# Altium schematic sheet schematic.SchDoc
size 464 x 561 mm; SheetNumber: 1; SheetTotal: 1
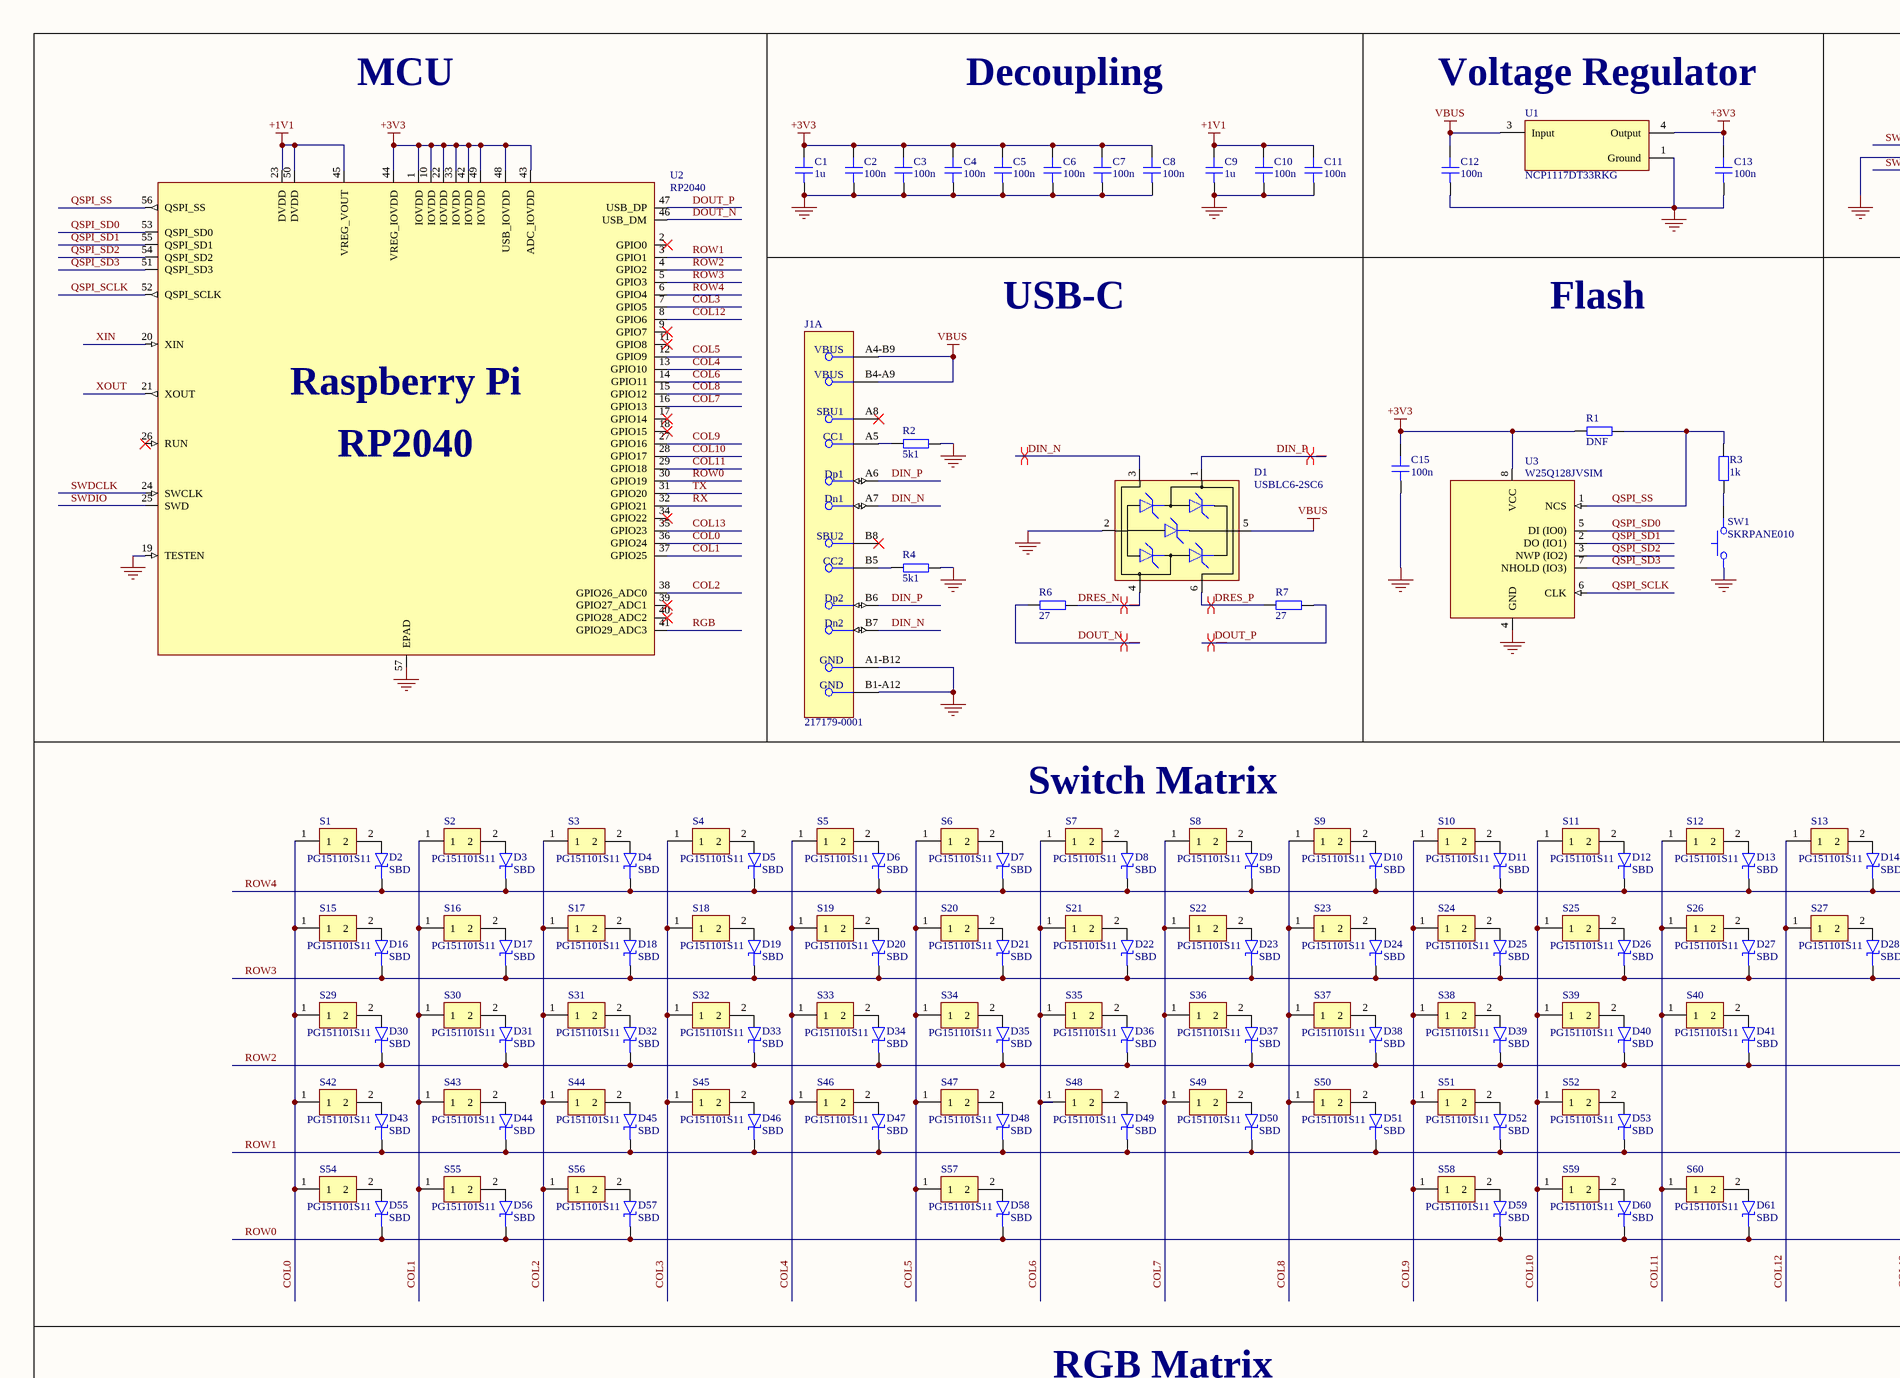
[diagram p0: schematic.SchDoc, top left]
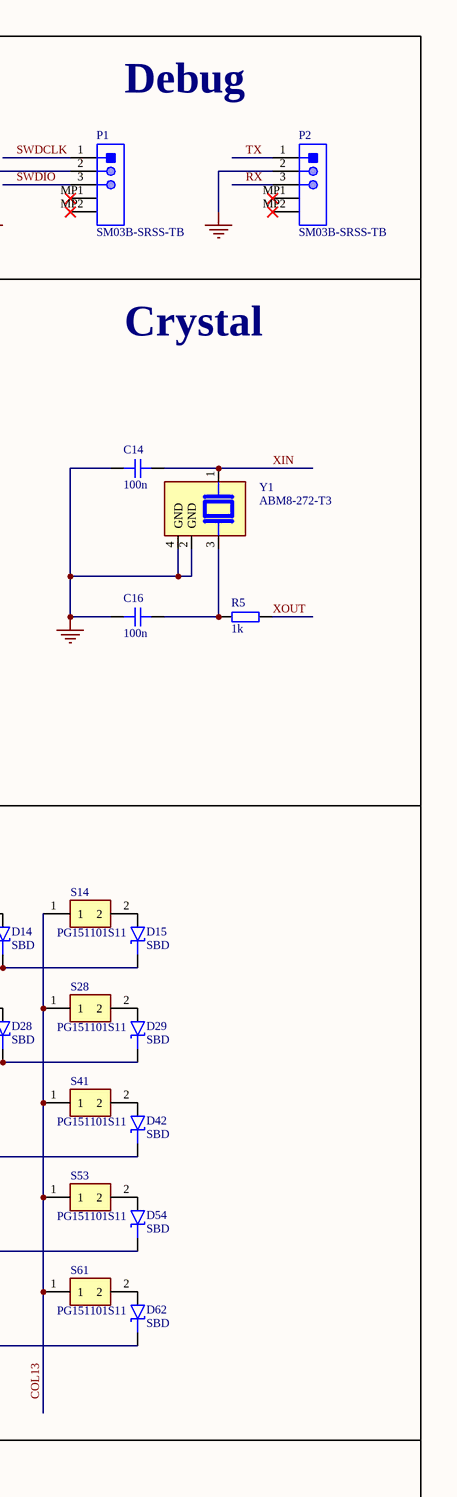
[diagram p1: schematic.SchDoc, top right]
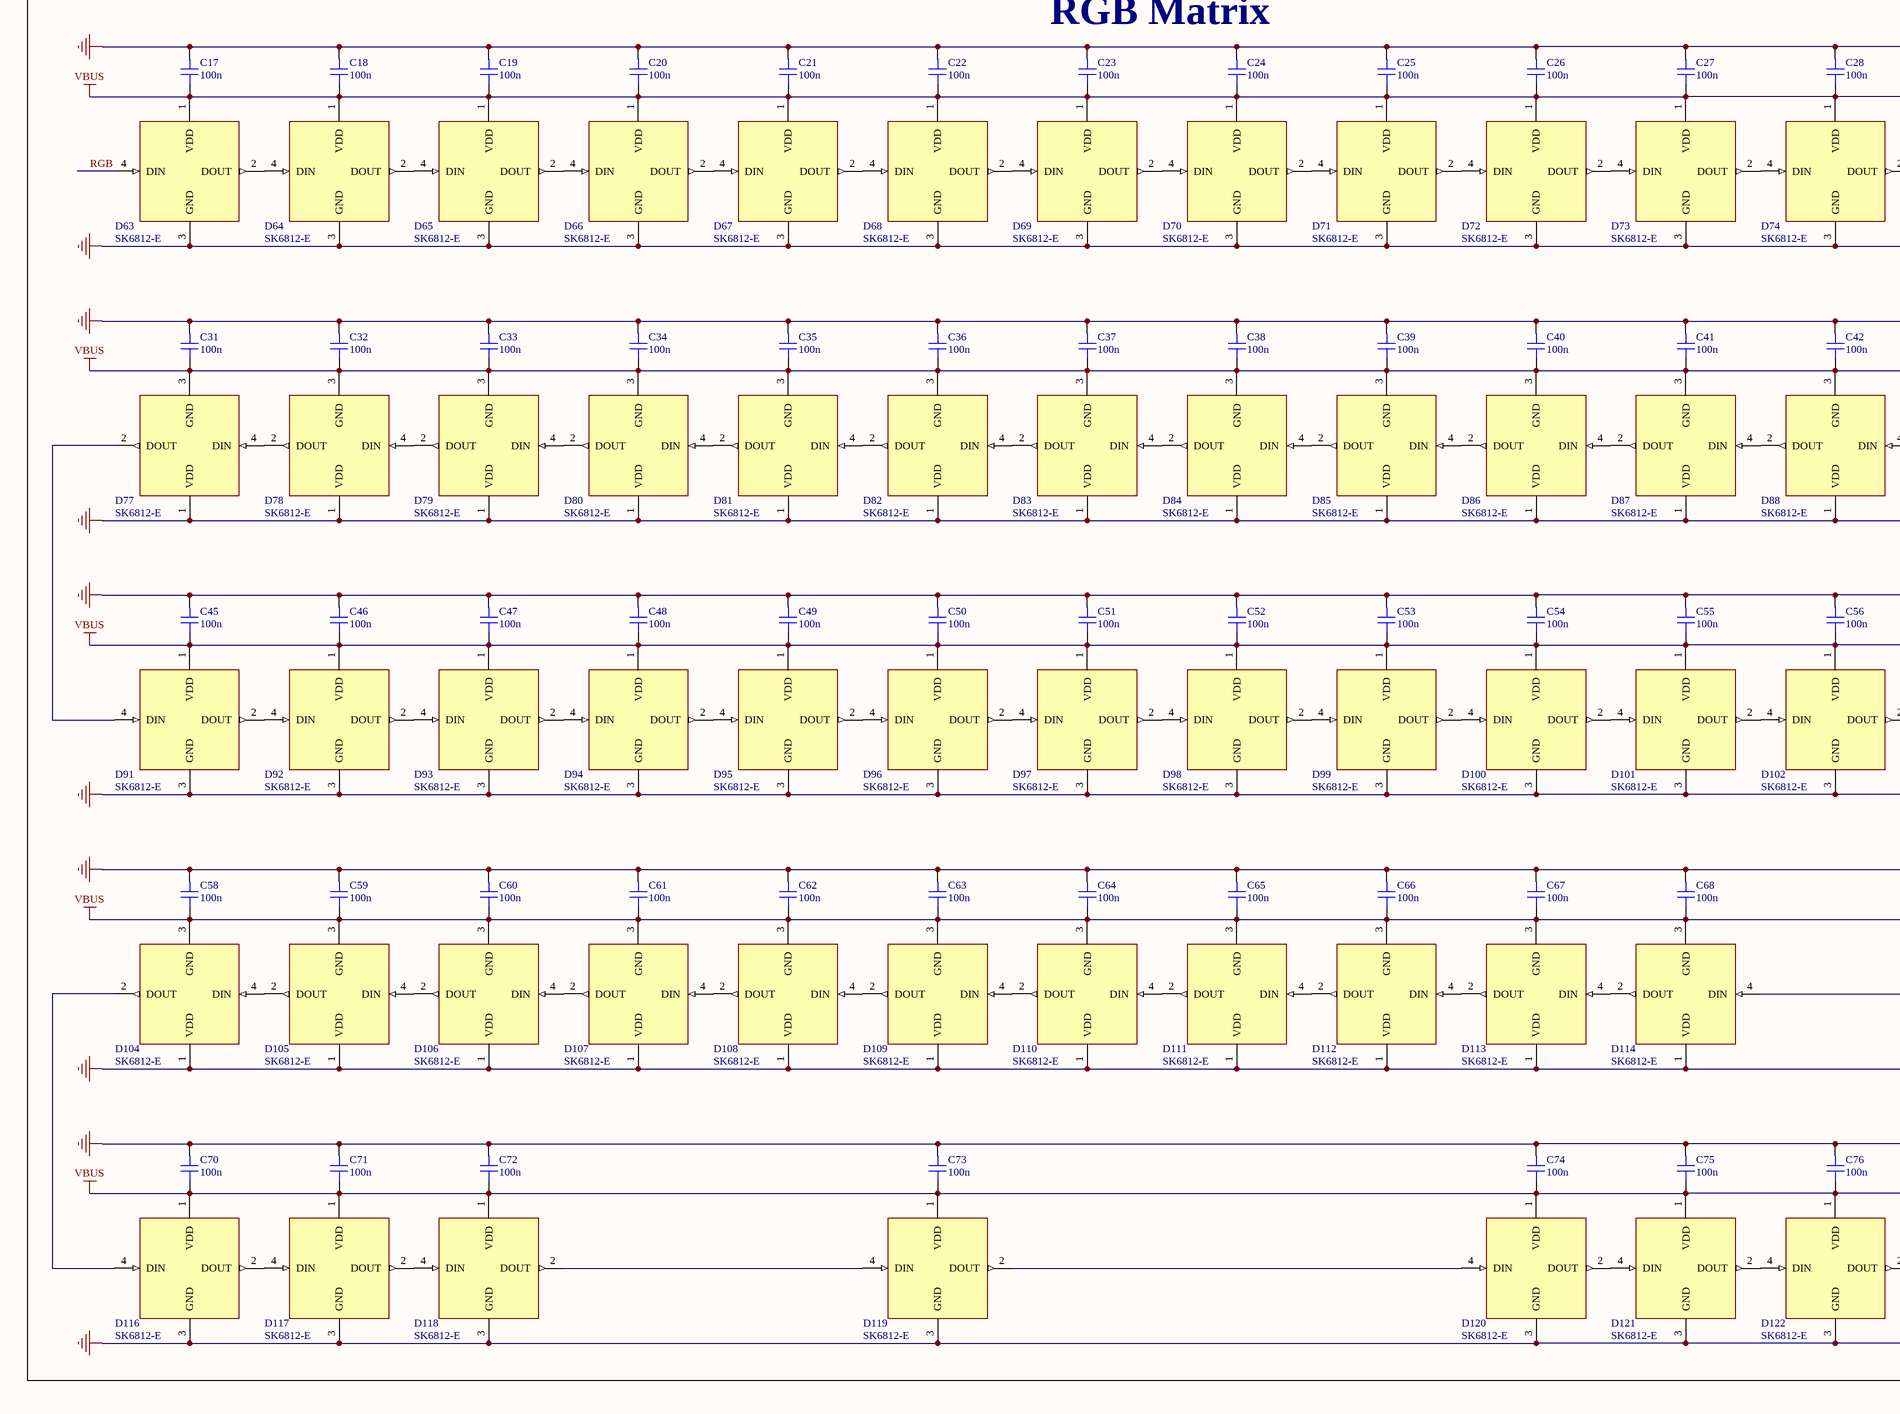
[diagram p2: schematic.SchDoc, bottom left]
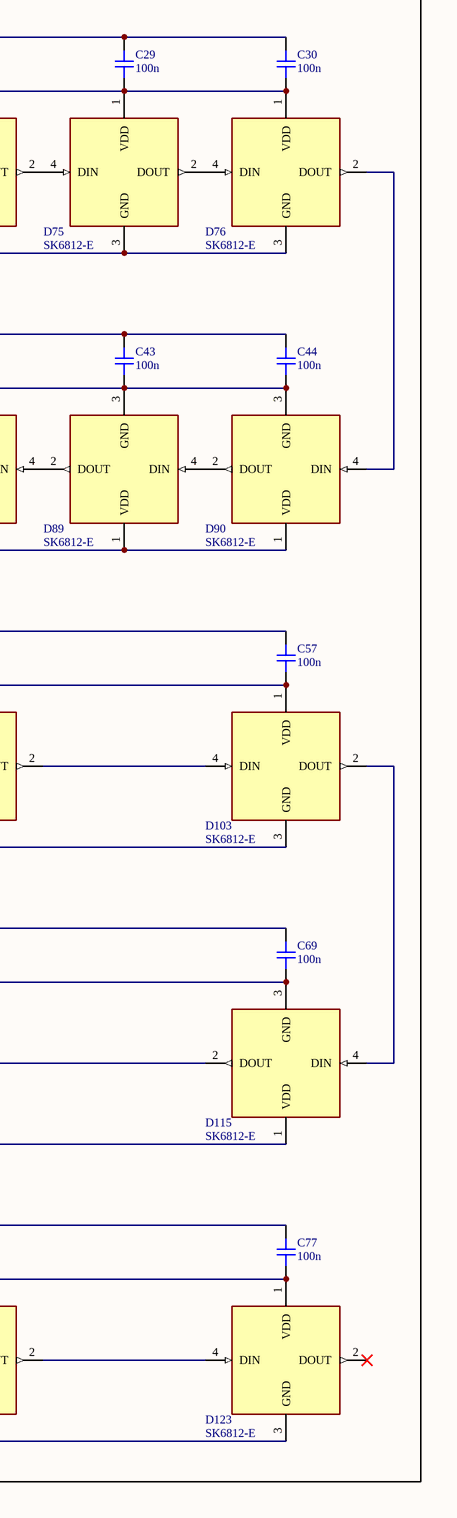
[diagram p3: schematic.SchDoc, bottom right]

## Parts
C1  1u  [CAP_0402]
C2  100n  [CAP_0402]
C3  100n  [CAP_0402]
C4  100n  [CAP_0402]
C5  100n  [CAP_0402]
C6  100n  [CAP_0402]
C7  100n  [CAP_0402]
C8  100n  [CAP_0402]
C9  1u  [CAP_0402]
C10  100n  [CAP_0402]
C11  100n  [CAP_0402]
C12  100n  [CAP_0402]
C13  100n  [CAP_0402]
C14  100n  [CAP_0402]
C15  100n  [CAP_0402]
C16  100n  [CAP_0402]
C17  100n  [CAP_1206]
C18  100n  [CAP_1206]
C19  100n  [CAP_1206]
C20  100n  [CAP_1206]
C21  100n  [CAP_1206]
C22  100n  [CAP_1206]
C23  100n  [CAP_1206]
C24  100n  [CAP_1206]
C25  100n  [CAP_1206]
C26  100n  [CAP_1206]
C27  100n  [CAP_1206]
C28  100n  [CAP_1206]
C29  100n  [CAP_1206]
C30  100n  [CAP_1206]
C31  100n  [CAP_1206]
C32  100n  [CAP_1206]
C33  100n  [CAP_1206]
C34  100n  [CAP_1206]
C35  100n  [CAP_1206]
C36  100n  [CAP_1206]
C37  100n  [CAP_1206]
C38  100n  [CAP_1206]
C39  100n  [CAP_1206]
C40  100n  [CAP_1206]
C41  100n  [CAP_1206]
C42  100n  [CAP_1206]
C43  100n  [CAP_1206]
C44  100n  [CAP_1206]
C45  100n  [CAP_1206]
C46  100n  [CAP_1206]
C47  100n  [CAP_1206]
C48  100n  [CAP_1206]
C49  100n  [CAP_1206]
C50  100n  [CAP_1206]
C51  100n  [CAP_1206]
C52  100n  [CAP_1206]
C53  100n  [CAP_1206]
C54  100n  [CAP_1206]
C55  100n  [CAP_1206]
C56  100n  [CAP_1206]
C57  100n  [CAP_1206]
C58  100n  [CAP_1206]
C59  100n  [CAP_1206]
C60  100n  [CAP_1206]
C61  100n  [CAP_1206]
C62  100n  [CAP_1206]
C63  100n  [CAP_1206]
C64  100n  [CAP_1206]
C65  100n  [CAP_1206]
C66  100n  [CAP_1206]
C67  100n  [CAP_1206]
C68  100n  [CAP_1206]
C69  100n  [CAP_1206]
C70  100n  [CAP_1206]
C71  100n  [CAP_1206]
C72  100n  [CAP_1206]
C73  100n  [CAP_1206]
C74  100n  [CAP_1206]
C75  100n  [CAP_1206]
C76  100n  [CAP_1206]
C77  100n  [CAP_1206]
D1  USBLC6-2SC6  [SOT-23-6]
D2  SBD  [SOD-323]
D3  SBD  [SOD-323]
D4  SBD  [SOD-323]
D5  SBD  [SOD-323]
D6  SBD  [SOD-323]
D7  SBD  [SOD-323]
D8  SBD  [SOD-323]
D9  SBD  [SOD-323]
D10  SBD  [SOD-323]
D11  SBD  [SOD-323]
D12  SBD  [SOD-323]
D13  SBD  [SOD-323]
D14  SBD  [SOD-323]
D15  SBD  [SOD-323]
D16  SBD  [SOD-323]
D17  SBD  [SOD-323]
D18  SBD  [SOD-323]
D19  SBD  [SOD-323]
D20  SBD  [SOD-323]
D21  SBD  [SOD-323]
D22  SBD  [SOD-323]
D23  SBD  [SOD-323]
D24  SBD  [SOD-323]
D25  SBD  [SOD-323]
D26  SBD  [SOD-323]
D27  SBD  [SOD-323]
D28  SBD  [SOD-323]
D29  SBD  [SOD-323]
D30  SBD  [SOD-323]
D31  SBD  [SOD-323]
D32  SBD  [SOD-323]
D33  SBD  [SOD-323]
D34  SBD  [SOD-323]
D35  SBD  [SOD-323]
D36  SBD  [SOD-323]
D37  SBD  [SOD-323]
D38  SBD  [SOD-323]
D39  SBD  [SOD-323]
D40  SBD  [SOD-323]
D41  SBD  [SOD-323]
D42  SBD  [SOD-323]
D43  SBD  [SOD-323]
D44  SBD  [SOD-323]
D45  SBD  [SOD-323]
D46  SBD  [SOD-323]
D47  SBD  [SOD-323]
D48  SBD  [SOD-323]
D49  SBD  [SOD-323]
D50  SBD  [SOD-323]
D51  SBD  [SOD-323]
D52  SBD  [SOD-323]
D53  SBD  [SOD-323]
D54  SBD  [SOD-323]
D55  SBD  [SOD-323]
D56  SBD  [SOD-323]
D57  SBD  [SOD-323]
D58  SBD  [SOD-323]
D59  SBD  [SOD-323]
D60  SBD  [SOD-323]
D61  SBD  [SOD-323]
D62  SBD  [SOD-323]
D63  SK6812-E  [LED_SK6812-E]
D64  SK6812-E  [LED_SK6812-E]
D65  SK6812-E  [LED_SK6812-E]
D66  SK6812-E  [LED_SK6812-E]
D67  SK6812-E  [LED_SK6812-E]
D68  SK6812-E  [LED_SK6812-E]
D69  SK6812-E  [LED_SK6812-E]
D70  SK6812-E  [LED_SK6812-E]
D71  SK6812-E  [LED_SK6812-E]
D72  SK6812-E  [LED_SK6812-E]
D73  SK6812-E  [LED_SK6812-E]
D74  SK6812-E  [LED_SK6812-E]
D75  SK6812-E  [LED_SK6812-E]
D76  SK6812-E  [LED_SK6812-E]
D77  SK6812-E  [LED_SK6812-E]
D78  SK6812-E  [LED_SK6812-E]
D79  SK6812-E  [LED_SK6812-E]
D80  SK6812-E  [LED_SK6812-E]
D81  SK6812-E  [LED_SK6812-E]
D82  SK6812-E  [LED_SK6812-E]
D83  SK6812-E  [LED_SK6812-E]
D84  SK6812-E  [LED_SK6812-E]
D85  SK6812-E  [LED_SK6812-E]
D86  SK6812-E  [LED_SK6812-E]
D87  SK6812-E  [LED_SK6812-E]
D88  SK6812-E  [LED_SK6812-E]
D89  SK6812-E  [LED_SK6812-E]
D90  SK6812-E  [LED_SK6812-E]
D91  SK6812-E  [LED_SK6812-E]
D92  SK6812-E  [LED_SK6812-E]
D93  SK6812-E  [LED_SK6812-E]
D94  SK6812-E  [LED_SK6812-E]
D95  SK6812-E  [LED_SK6812-E]
D96  SK6812-E  [LED_SK6812-E]
D97  SK6812-E  [LED_SK6812-E]
D98  SK6812-E  [LED_SK6812-E]
D99  SK6812-E  [LED_SK6812-E]
D100  SK6812-E  [LED_SK6812-E]
D101  SK6812-E  [LED_SK6812-E]
D102  SK6812-E  [LED_SK6812-E]
D103  SK6812-E  [LED_SK6812-E]
D104  SK6812-E  [LED_SK6812-E]
D105  SK6812-E  [LED_SK6812-E]
D106  SK6812-E  [LED_SK6812-E]
D107  SK6812-E  [LED_SK6812-E]
D108  SK6812-E  [LED_SK6812-E]
D109  SK6812-E  [LED_SK6812-E]
D110  SK6812-E  [LED_SK6812-E]
D111  SK6812-E  [LED_SK6812-E]
D112  SK6812-E  [LED_SK6812-E]
D113  SK6812-E  [LED_SK6812-E]
D114  SK6812-E  [LED_SK6812-E]
D115  SK6812-E  [LED_SK6812-E]
D116  SK6812-E  [LED_SK6812-E]
D117  SK6812-E  [LED_SK6812-E]
D118  SK6812-E  [LED_SK6812-E]
D119  SK6812-E  [LED_SK6812-E]
D120  SK6812-E  [LED_SK6812-E]
D121  SK6812-E  [LED_SK6812-E]
D122  SK6812-E  [LED_SK6812-E]
D123  SK6812-E  [LED_SK6812-E]
J1  217179-0001  [FP-2171790001-MFG]  (part A of 2)
P1  SM03B-SRSS-TB  [JST-SM03B-SRSS-TB_V]
P2  SM03B-SRSS-TB  [JST-SM03B-SRSS-TB_V]
R1  DNF  [RES_0402]
R2  5k1  [RES_0402]
R3  1k  [RES_0402]
R4  5k1  [RES_0402]
R5  1k  [RES_0402]
R6  27  [RES_0402]
R7  27  [RES_0402]
S1  PG151101S11  [SW_PG151101S11]
S2  PG151101S11  [SW_PG151101S11]
S3  PG151101S11  [SW_PG151101S11]
S4  PG151101S11  [SW_PG151101S11]
S5  PG151101S11  [SW_PG151101S11]
S6  PG151101S11  [SW_PG151101S11]
S7  PG151101S11  [SW_PG151101S11]
S8  PG151101S11  [SW_PG151101S11]
S9  PG151101S11  [SW_PG151101S11]
S10  PG151101S11  [SW_PG151101S11]
S11  PG151101S11  [SW_PG151101S11]
S12  PG151101S11  [SW_PG151101S11]
S13  PG151101S11  [SW_PG151101S11]
S14  PG151101S11  [SW_PG151101S11]
S15  PG151101S11  [SW_PG151101S11]
S16  PG151101S11  [SW_PG151101S11]
S17  PG151101S11  [SW_PG151101S11]
S18  PG151101S11  [SW_PG151101S11]
S19  PG151101S11  [SW_PG151101S11]
S20  PG151101S11  [SW_PG151101S11]
S21  PG151101S11  [SW_PG151101S11]
S22  PG151101S11  [SW_PG151101S11]
S23  PG151101S11  [SW_PG151101S11]
S24  PG151101S11  [SW_PG151101S11]
S25  PG151101S11  [SW_PG151101S11]
S26  PG151101S11  [SW_PG151101S11]
S27  PG151101S11  [SW_PG151101S11]
S28  PG151101S11  [SW_PG151101S11]
S29  PG151101S11  [SW_PG151101S11]
S30  PG151101S11  [SW_PG151101S11]
S31  PG151101S11  [SW_PG151101S11]
S32  PG151101S11  [SW_PG151101S11]
S33  PG151101S11  [SW_PG151101S11]
S34  PG151101S11  [SW_PG151101S11]
S35  PG151101S11  [SW_PG151101S11]
S36  PG151101S11  [SW_PG151101S11]
S37  PG151101S11  [SW_PG151101S11]
S38  PG151101S11  [SW_PG151101S11]
S39  PG151101S11  [SW_PG151101S11]
S40  PG151101S11  [SW_PG151101S11]
S41  PG151101S11  [SW_PG151101S11]
S42  PG151101S11  [SW_PG151101S11]
S43  PG151101S11  [SW_PG151101S11]
S44  PG151101S11  [SW_PG151101S11]
S45  PG151101S11  [SW_PG151101S11]
S46  PG151101S11  [SW_PG151101S11]
S47  PG151101S11  [SW_PG151101S11]
S48  PG151101S11  [SW_PG151101S11]
S49  PG151101S11  [SW_PG151101S11]
S50  PG151101S11  [SW_PG151101S11]
S51  PG151101S11  [SW_PG151101S11]
S52  PG151101S11  [SW_PG151101S11]
S53  PG151101S11  [SW_PG151101S11]
S54  PG151101S11  [SW_PG151101S11]
S55  PG151101S11  [SW_PG151101S11]
S56  PG151101S11  [SW_PG151101S11]
S57  PG151101S11  [SW_PG151101S11]
S58  PG151101S11  [SW_PG151101S11]
S59  PG151101S11  [SW_PG151101S11]
S60  PG151101S11  [SW_PG151101S11]
S61  PG151101S11  [SW_PG151101S11]
SW1  SKRPANE010  [SKRPANE010]
U1  NCP1117DT33RKG  [FP-369C-MFG]
U2  RP2040  [QFN-56-EP]
U3  W25Q128JVSIM  [SOIC-8]
Y1  ABM8-272-T3  [XTAL_ABM8-272-T3]

## Nets
+1V1: C9.2 C10.2 C11.2 U2.23(DVDD) U2.45(VREG_VOUT) U2.50(DVDD)
+3V3: C1.2 C2.2 C3.2 C4.2 C5.2 C6.2 C7.2 C8.2 C13.2 C15.2 R1.1 U1.4(Output) U2.1(IOVDD) U2.10(IOVDD) U2.22(IOVDD) U2.33(IOVDD) U2.42(IOVDD) U2.43(ADC_IOVDD) U2.44(VREG_IOVDD) U2.48(USB_IOVDD) U2.49(IOVDD) U3.8(VCC)
GND: C1.1 C2.1 C3.1 C4.1 C5.1 C6.1 C7.1 C8.1 C9.1 C10.1 C11.1 C12.1 C13.1 C14.2 C15.1 C16.2 C17.1 C18.1 C19.1 C20.1 C21.1 C22.1 C23.1 C24.1 C25.1 C26.1 C27.1 C28.1 C29.1 C30.1 C31.1 C32.1 C33.1 C34.1 C35.1 C36.1 C37.1 C38.1 C39.1 C40.1 C41.1 C42.1 C43.1 C44.1 C45.1 C46.1 C47.1 C48.1 C49.1 C50.1 C51.1 C52.1 C53.1 C54.1 C55.1 C56.1 C57.1 C58.1 C59.1 C60.1 C61.1 C62.1 C63.1 C64.1 C65.1 C66.1 C67.1 C68.1 C69.1 C70.1 C71.1 C72.1 C73.1 C74.1 C75.1 C76.1 C77.1 D1.2(GND) D63.3(GND) D64.3(GND) D65.3(GND) D66.3(GND) D67.3(GND) D68.3(GND) D69.3(GND) D70.3(GND) D71.3(GND) D72.3(GND) D73.3(GND) D74.3(GND) D75.3(GND) D76.3(GND) D77.1(VDD) D78.1(VDD) D79.1(VDD) D80.1(VDD) D81.1(VDD) D82.1(VDD) D83.1(VDD) D84.1(VDD) D85.1(VDD) D86.1(VDD) D87.1(VDD) D88.1(VDD) D89.1(VDD) D90.1(VDD) D91.3(GND) D92.3(GND) D93.3(GND) D94.3(GND) D95.3(GND) D96.3(GND) D97.3(GND) D98.3(GND) D99.3(GND) D100.3(GND) D101.3(GND) D102.3(GND) D103.3(GND) D104.1(VDD) D105.1(VDD) D106.1(VDD) D107.1(VDD) D108.1(VDD) D109.1(VDD) D110.1(VDD) D111.1(VDD) D112.1(VDD) D113.1(VDD) D114.1(VDD) D115.1(VDD) D116.3(GND) D117.3(GND) D118.3(GND) D119.3(GND) D120.3(GND) D121.3(GND) D122.3(GND) D123.3(GND) J1.A1-B12(GND) J1.B1-A12(GND) P1.2 P2.2 R2.2 R4.2 SW1.12 U1.1(Ground) U2.19(TESTEN) U2.57(EPAD) U3.4(GND) Y1.2(GND) Y1.4(GND)
VBUS: C12.2 C17.2 C18.2 C19.2 C20.2 C21.2 C22.2 C23.2 C24.2 C25.2 C26.2 C27.2 C28.2 C29.2 C30.2 C31.2 C32.2 C33.2 C34.2 C35.2 C36.2 C37.2 C38.2 C39.2 C40.2 C41.2 C42.2 C43.2 C44.2 C45.2 C46.2 C47.2 C48.2 C49.2 C50.2 C51.2 C52.2 C53.2 C54.2 C55.2 C56.2 C57.2 C58.2 C59.2 C60.2 C61.2 C62.2 C63.2 C64.2 C65.2 C66.2 C67.2 C68.2 C69.2 C70.2 C71.2 C72.2 C73.2 C74.2 C75.2 C76.2 C77.2 D1.5(VBUS) D63.1(VDD) D64.1(VDD) D65.1(VDD) D66.1(VDD) D67.1(VDD) D68.1(VDD) D69.1(VDD) D70.1(VDD) D71.1(VDD) D72.1(VDD) D73.1(VDD) D74.1(VDD) D75.1(VDD) D76.1(VDD) D77.3(GND) D78.3(GND) D79.3(GND) D80.3(GND) D81.3(GND) D82.3(GND) D83.3(GND) D84.3(GND) D85.3(GND) D86.3(GND) D87.3(GND) D88.3(GND) D89.3(GND) D90.3(GND) D91.1(VDD) D92.1(VDD) D93.1(VDD) D94.1(VDD) D95.1(VDD) D96.1(VDD) D97.1(VDD) D98.1(VDD) D99.1(VDD) D100.1(VDD) D101.1(VDD) D102.1(VDD) D103.1(VDD) D104.3(GND) D105.3(GND) D106.3(GND) D107.3(GND) D108.3(GND) D109.3(GND) D110.3(GND) D111.3(GND) D112.3(GND) D113.3(GND) D114.3(GND) D115.3(GND) D116.1(VDD) D117.1(VDD) D118.1(VDD) D119.1(VDD) D120.1(VDD) D121.1(VDD) D122.1(VDD) D123.1(VDD) J1.A4-B9(VBUS) J1.B4-A9(VBUS) U1.3(Input)
COL0: S1.1 S15.1 S29.1 S42.1 S54.1 U2.36(GPIO24)
COL1: S2.1 S16.1 S30.1 S43.1 S55.1 U2.37(GPIO25)
COL2: S3.1 S17.1 S31.1 S44.1 S56.1 U2.38(GPIO26_ADC0)
COL3: S4.1 S18.1 S32.1 S45.1 U2.7(GPIO5)
COL4: S5.1 S19.1 S33.1 S46.1 U2.13(GPIO10)
COL5: S6.1 S20.1 S34.1 S47.1 S57.1 U2.12(GPIO9)
COL6: S7.1 S21.1 S35.1 S48.1 U2.14(GPIO11)
COL7: S8.1 S22.1 S36.1 S49.1 U2.16(GPIO13)
COL8: S9.1 S23.1 S37.1 S50.1 U2.15(GPIO12)
COL9: S10.1 S24.1 S38.1 S51.1 S58.1 U2.27(GPIO16)
COL10: S11.1 S25.1 S39.1 S52.1 S59.1 U2.28(GPIO17)
COL11: S12.1 S26.1 S40.1 S60.1 U2.29(GPIO18)
COL12: S13.1 S27.1 U2.8(GPIO6)
COL13: S14.1 S28.1 S41.1 S53.1 S61.1 U2.35(GPIO23)
DIN_N: D1.3(IO2) J1.A7(Dn1) J1.B7(Dn2)
DIN_P: D1.1(IO1) J1.A6(Dp1) J1.B6(Dp2)
DOUT_N: R6.1 U2.46(USB_DM)
DOUT_P: R7.2 U2.47(USB_DP)
DRES_N: D1.4(IO2) R6.2
DRES_P: D1.6(IO1) R7.1
QSPI_SCLK: U2.52(QSPI_SCLK) U3.6(CLK)
QSPI_SD0: U2.53(QSPI_SD0) U3.5(DI_(IO0))
QSPI_SD1: U2.55(QSPI_SD1) U3.2(DO_(IO1))
QSPI_SD2: U2.54(QSPI_SD2) U3.3(NWP_(IO2))
QSPI_SD3: U2.51(QSPI_SD3) U3.7(NHOLD_(IO3))
QSPI_SS: R1.2 R3.2 U2.56(QSPI_SS) U3.1(NCS)
RGB: D63.4(DIN) U2.41(GPIO29_ADC3)
ROW0: D55.K D56.K D57.K D58.K D59.K D60.K D61.K D62.K U2.30(GPIO19)
ROW1: D43.K D44.K D45.K D46.K D47.K D48.K D49.K D50.K D51.K D52.K D53.K D54.K U2.3(GPIO1)
ROW2: D30.K D31.K D32.K D33.K D34.K D35.K D36.K D37.K D38.K D39.K D40.K D41.K D42.K U2.4(GPIO2)
ROW3: D16.K D17.K D18.K D19.K D20.K D21.K D22.K D23.K D24.K D25.K D26.K D27.K D28.K D29.K U2.5(GPIO3)
ROW4: D2.K D3.K D4.K D5.K D6.K D7.K D8.K D9.K D10.K D11.K D12.K D13.K D14.K D15.K U2.6(GPIO4)
RX: P2.3 U2.32(GPIO21)
SWDCLK: P1.1 U2.24(SWCLK)
SWDIO: P1.3 U2.25(SWD)
TX: P2.1 U2.31(GPIO20)
XIN: C14.1 U2.20(XIN) Y1.1
XOUT: R5.1 U2.21(XOUT)
NetC16_1: C16.1 R5.2 Y1.3
NetD2_A: D2.A S1.2
NetD3_A: D3.A S2.2
NetD4_A: D4.A S3.2
NetD5_A: D5.A S4.2
NetD6_A: D6.A S5.2
NetD7_A: D7.A S6.2
NetD8_A: D8.A S7.2
NetD9_A: D9.A S8.2
NetD10_A: D10.A S9.2
NetD11_A: D11.A S10.2
NetD12_A: D12.A S11.2
NetD13_A: D13.A S12.2
NetD14_A: D14.A S13.2
NetD15_A: D15.A S14.2
NetD16_A: D16.A S15.2
NetD17_A: D17.A S16.2
NetD18_A: D18.A S17.2
NetD19_A: D19.A S18.2
NetD20_A: D20.A S19.2
NetD21_A: D21.A S20.2
NetD22_A: D22.A S21.2
NetD23_A: D23.A S22.2
NetD24_A: D24.A S23.2
NetD25_A: D25.A S24.2
NetD26_A: D26.A S25.2
NetD27_A: D27.A S26.2
NetD28_A: D28.A S27.2
NetD29_A: D29.A S28.2
NetD30_A: D30.A S29.2
NetD31_A: D31.A S30.2
NetD32_A: D32.A S31.2
NetD33_A: D33.A S32.2
NetD34_A: D34.A S33.2
NetD35_A: D35.A S34.2
NetD36_A: D36.A S35.2
NetD37_A: D37.A S36.2
NetD38_A: D38.A S37.2
NetD39_A: D39.A S38.2
NetD40_A: D40.A S39.2
NetD41_A: D41.A S40.2
NetD42_A: D42.A S41.2
NetD43_A: D43.A S42.2
NetD44_A: D44.A S43.2
NetD45_A: D45.A S44.2
NetD46_A: D46.A S45.2
NetD47_A: D47.A S46.2
NetD48_A: D48.A S47.2
NetD49_A: D49.A S48.2
NetD50_A: D50.A S49.2
NetD51_A: D51.A S50.2
NetD52_A: D52.A S51.2
NetD53_A: D53.A S52.2
NetD54_A: D54.A S53.2
NetD55_A: D55.A S54.2
NetD56_A: D56.A S55.2
NetD57_A: D57.A S56.2
NetD58_A: D58.A S57.2
NetD59_A: D59.A S58.2
NetD60_A: D60.A S59.2
NetD61_A: D61.A S60.2
NetD62_A: D62.A S61.2
NetD63_2: D63.2(DOUT) D64.4(DIN)
NetD64_2: D64.2(DOUT) D65.4(DIN)
NetD65_2: D65.2(DOUT) D66.4(DIN)
NetD66_2: D66.2(DOUT) D67.4(DIN)
NetD67_2: D67.2(DOUT) D68.4(DIN)
NetD68_2: D68.2(DOUT) D69.4(DIN)
NetD69_2: D69.2(DOUT) D70.4(DIN)
NetD70_2: D70.2(DOUT) D71.4(DIN)
NetD71_2: D71.2(DOUT) D72.4(DIN)
NetD72_2: D72.2(DOUT) D73.4(DIN)
NetD73_2: D73.2(DOUT) D74.4(DIN)
NetD74_2: D74.2(DOUT) D75.4(DIN)
NetD75_2: D75.2(DOUT) D76.4(DIN)
NetD76_2: D76.2(DOUT) D90.4(DIN)
NetD77_2: D77.2(DOUT) D91.4(DIN)
NetD77_4: D77.4(DIN) D78.2(DOUT)
NetD78_4: D78.4(DIN) D79.2(DOUT)
NetD79_4: D79.4(DIN) D80.2(DOUT)
NetD80_4: D80.4(DIN) D81.2(DOUT)
NetD81_4: D81.4(DIN) D82.2(DOUT)
NetD82_4: D82.4(DIN) D83.2(DOUT)
NetD83_4: D83.4(DIN) D84.2(DOUT)
NetD84_4: D84.4(DIN) D85.2(DOUT)
NetD85_4: D85.4(DIN) D86.2(DOUT)
NetD86_4: D86.4(DIN) D87.2(DOUT)
NetD87_4: D87.4(DIN) D88.2(DOUT)
NetD88_4: D88.4(DIN) D89.2(DOUT)
NetD89_4: D89.4(DIN) D90.2(DOUT)
NetD91_2: D91.2(DOUT) D92.4(DIN)
NetD92_2: D92.2(DOUT) D93.4(DIN)
NetD93_2: D93.2(DOUT) D94.4(DIN)
NetD94_2: D94.2(DOUT) D95.4(DIN)
NetD95_2: D95.2(DOUT) D96.4(DIN)
NetD96_2: D96.2(DOUT) D97.4(DIN)
NetD97_2: D97.2(DOUT) D98.4(DIN)
NetD98_2: D98.2(DOUT) D99.4(DIN)
NetD99_2: D99.2(DOUT) D100.4(DIN)
NetD100_2: D100.2(DOUT) D101.4(DIN)
NetD101_2: D101.2(DOUT) D102.4(DIN)
NetD102_2: D102.2(DOUT) D103.4(DIN)
NetD103_2: D103.2(DOUT) D115.4(DIN)
NetD104_2: D104.2(DOUT) D116.4(DIN)
NetD104_4: D104.4(DIN) D105.2(DOUT)
NetD105_4: D105.4(DIN) D106.2(DOUT)
NetD106_4: D106.4(DIN) D107.2(DOUT)
NetD107_4: D107.4(DIN) D108.2(DOUT)
NetD108_4: D108.4(DIN) D109.2(DOUT)
NetD109_4: D109.4(DIN) D110.2(DOUT)
NetD110_4: D110.4(DIN) D111.2(DOUT)
NetD111_4: D111.4(DIN) D112.2(DOUT)
NetD112_4: D112.4(DIN) D113.2(DOUT)
NetD113_4: D113.4(DIN) D114.2(DOUT)
NetD114_4: D114.4(DIN) D115.2(DOUT)
NetD116_2: D116.2(DOUT) D117.4(DIN)
NetD117_2: D117.2(DOUT) D118.4(DIN)
NetD118_2: D118.2(DOUT) D119.4(DIN)
NetD119_2: D119.2(DOUT) D120.4(DIN)
NetD120_2: D120.2(DOUT) D121.4(DIN)
NetD121_2: D121.2(DOUT) D122.4(DIN)
NetD122_2: D122.2(DOUT) D123.4(DIN)
NetJ1_A5: J1.A5(CC1) R2.1
NetJ1_B5: J1.B5(CC2) R4.1
NetR3_1: R3.1 SW1.34

Not connected (* = marked no-connect by the designer): D123 2(DOUT)*; J1 A8(SBU1)* B8(SBU2)*; P1 MP1* MP2*; P2 MP1* MP2*; U2 2(GPIO0)* 9(GPIO7)* 11(GPIO8)* 17(GPIO14)* 18(GPIO15)* 26(RUN)* 34(GPIO22)* 39(GPIO27_ADC1)* 40(GPIO28_ADC2)*

## Layout directives
differential pair: DIN_N, DIN_P, DOUT_N, DOUT_P, DRES_N, DRES_P

## Notes on the sheet
- MCU
- Decoupling
- (near U1) Voltage Regulator
- Debug
- USB-C
- Flash
- Crystal
- Switch Matrix
- RGB Matrix

## Library data of the parts
C1-C16 = CAP_0402: Capacitor SMD 0402; Manufacturer: *; Manufacturer Part Number: *; Distributor Link: *; LCSC: *; Rating: *; Dielectric: *
C17-C77 = CAP_1206: Capacitor SMD 1206; Manufacturer: *; Manufacturer Part Number: *; Distributor Link: *; LCSC: *; Rating: *; Dielectric: *
D1 = USBLC6-2SC6: Low-Capacitance ESD Protection USB; Manufacturer: STMicroelectronics; Manufacturer Part Number: USBLC6-2SC6; Distributor Link: https://www.mouser.de/ProductDetail/STMicroelectronics/USBLC6-2SC6?qs=po45yt2pPpu%2FhNIlwQdTlg%3D%3D
D2-D62 = D_SCHOTTKY_SOD_323: Diode Schottky SMD SOD-323
D63-D123 = SK6812-E: SK6812MINI-E is a smart LED control circuit and light emitting circuit in one controlled LED source, which has the shape of a 3528 LED chip.; MF: DONGGUANG OPSCO OPTOELECTRONICS CO., LTD; SnapEDA_Link: https://www.snapeda.com/parts/SK6812-E/DONGGUANG+OPSCO+OPTOELECTRONICS+CO.%252C+LTD/view-part/?ref=snap; Package: Package; Value: *; MP: SK6812-E; Check_prices: https://www.snapeda.com/parts/SK6812-E/DONGGUANG+OPSCO+OPTOELECTRONICS+CO.%252C+LTD/view-part/?ref=eda
J1 = CMP-04767-000028-2: CONN RCP USB2.0 TYP C 24P SMD RA; NexarPartId: 117190526; Gender: Receptacle; Number of Contacts: 16; Current Rating: 1.25A; Voltage Rating: 30V; Min Operating Temperature: -40°C; USB Standard: USB 2.0; Height: 3.36mm; Contact Material: Gold, Nickel; Max Operating Temperature: 85°C
P1 P2 = CMP-2000-07077-1: Male Header, Pitch 1 mm, 1 x 3 Position, Height 2.9 mm, -25 to 85 degC, RoHS, Tape and Reel; Manufacturer: JST; Pitch: 1mm; Style/Orientation: RightAngleHeader/Plug; No of Positions: 3; Package Description: Male Header, Pitch 1 mm, 1 x 3 Position, Height 2.9 mm; Manufacturer URL: http://www.jst.com/home2.html; Package Reference: SM03B-SRSS-TB; Type: ShroudedHeader; Termination: Crimp; Mounting Technology: SurfaceMount; Datasheet Version: 11/2010; Datasheet URL: https://datasheet.ciiva.com/26894/getdatasheetpartid-708885-26894671.pdf
R1-R7 = RES_0402: Resistor SMD 0402; Manufacturer: *; Manufacturer Part Number: *; Distributor Link: *; LCSC: *
S1-S61 = PG151101S11: Kailh Hotswap MX Socket; SnapEDA_Link: https://www.snapeda.com/parts/PG151101S11/Kailh/view-part/?ref=snap; Package: Package; Value: *; MF: Kailh; MP: PG151101S11; Check_prices: https://www.snapeda.com/parts/PG151101S11/Kailh/view-part/?ref=eda
SW1 = SKRPANE010: Tactile Switch SMD SPST; Manufacturer: Alps Alpine; Manufacturer Part Number: SKRPANE010
U1 = CMP-07128-000036-1: IC REG LINEAR 3.3V 1A DPAK-3; Accuracy: 1%; Input Bias Current: 6mA; Min Input Voltage: 10V; Reference Voltage: 1.27V; Dropout Voltage: 1.07V; Number of Regulators: 1; Output Type: Fixed; Quiescent Current: 10mA; Max Input Voltage: 20V; Polarity: Positive; Packaging: Tape and Reel; Number of Pins: 3; Min Current Limit: 1A; Max Output Current: 1A; REACH SVHC: No SVHC; Nominal Output Voltage: 3.3V; Case/Package: DPAK; Min Output Voltage: 3.3V; Length: 6.73mm; Output Voltage Accuracy: 1%; Radiation Hardening: No; Min Operating Temperature: 0°C; Halogen Free: Halogen Free; Width: 6.22mm; Output Voltage: 3.3V; Height: 2.38mm; Lead Free: Lead Free; Output Current: 1A; Package Quantity: 1; Contact Plating: Tin; Number of Outputs: 1; Max Operating Temperature: 125°C; Mount: Surface Mount; Current Rating: 1A
U2 = RP2040: 32-Bit Dual-Core ARM Cortex-M0+ Microcontroller; Manufacturer: Raspberry Pi; Manufacturer Part Number: RP2040
U3 = W25Q128JVSIM: 128M-BIT / SERIAL FLASH MEMORY WITH / DUAL/QUAD SPI & QPI & DTR SOIC-8; Manufacturer: Winbond; Manufacturer Part Number: W25Q128JVSIM
Y1 = ABM8-272-T3: 12 MHz Â±30ppm Crystal 10pF 50 Ohms 4-SMD, No Lead; MF: ABRACON; SnapEDA_Link: https://www.snapeda.com/parts/ABM8-272-T3/Abracon/view-part/?ref=snap; Package: NON-STANDARD-4 Abracon; Value: *; MP: ABM8-272-T3; Check_prices: https://www.snapeda.com/parts/ABM8-272-T3/Abracon/view-part/?ref=eda